# Altium schematic sheet DDR3.SchDoc
size 558 x 431 mm; SheetNumber: 6; SheetTotal: 23; Sheet_Name: DDR3; Size: 11x17
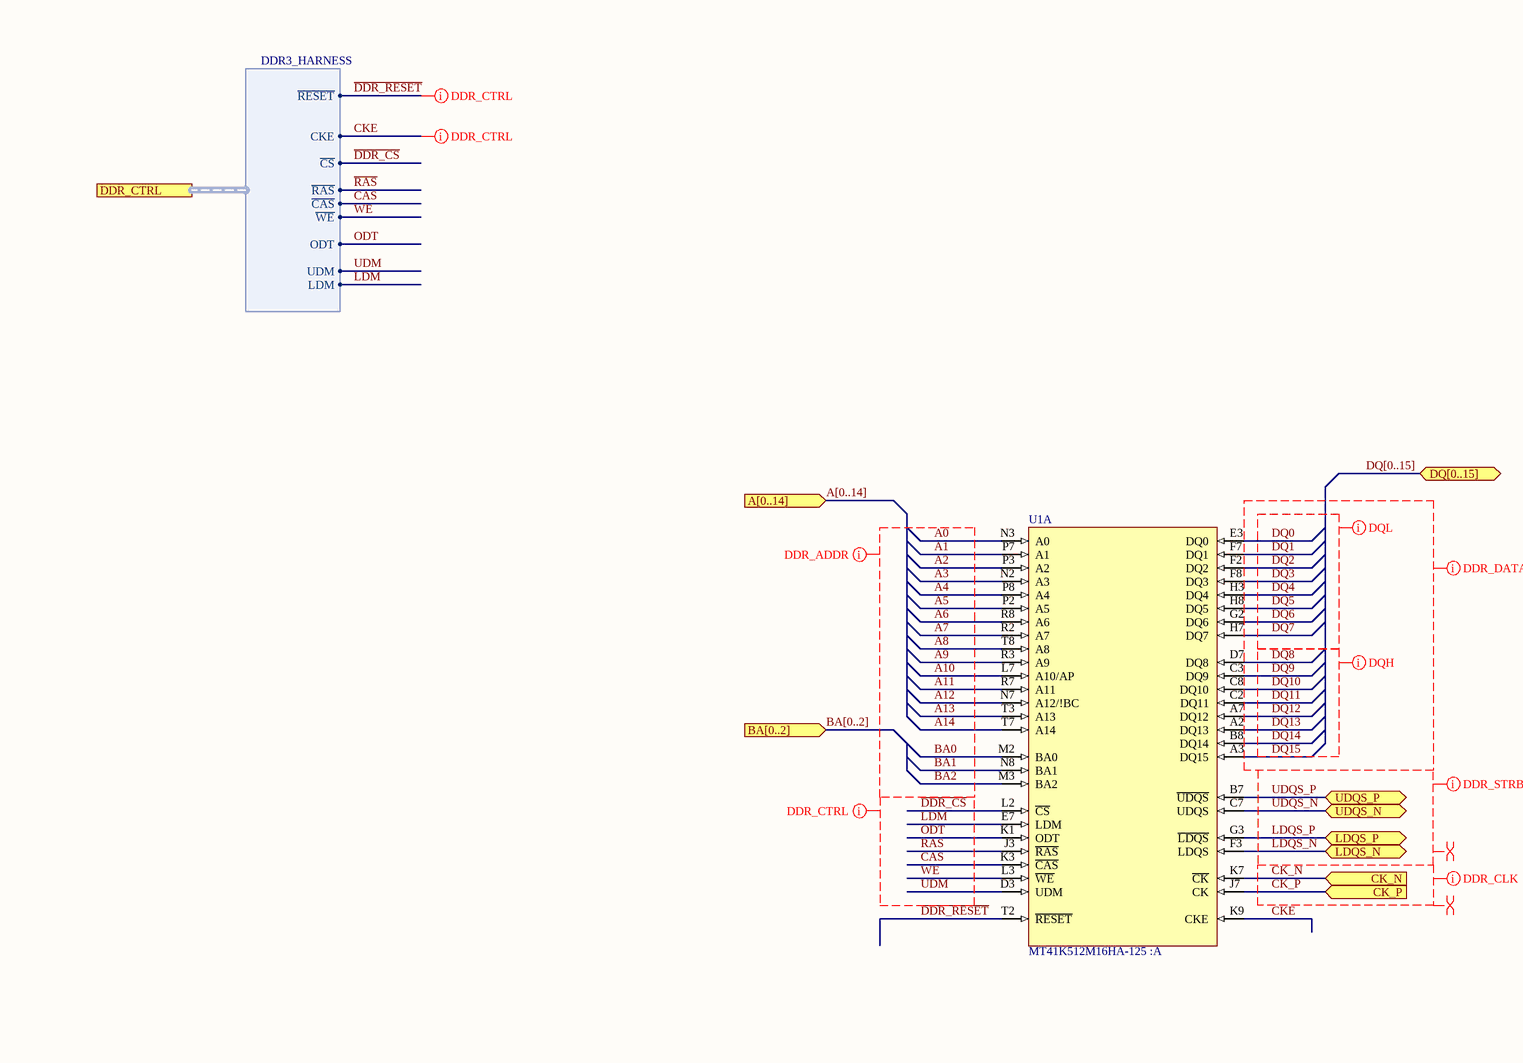
[diagram p0: DDR3.SchDoc, top left]
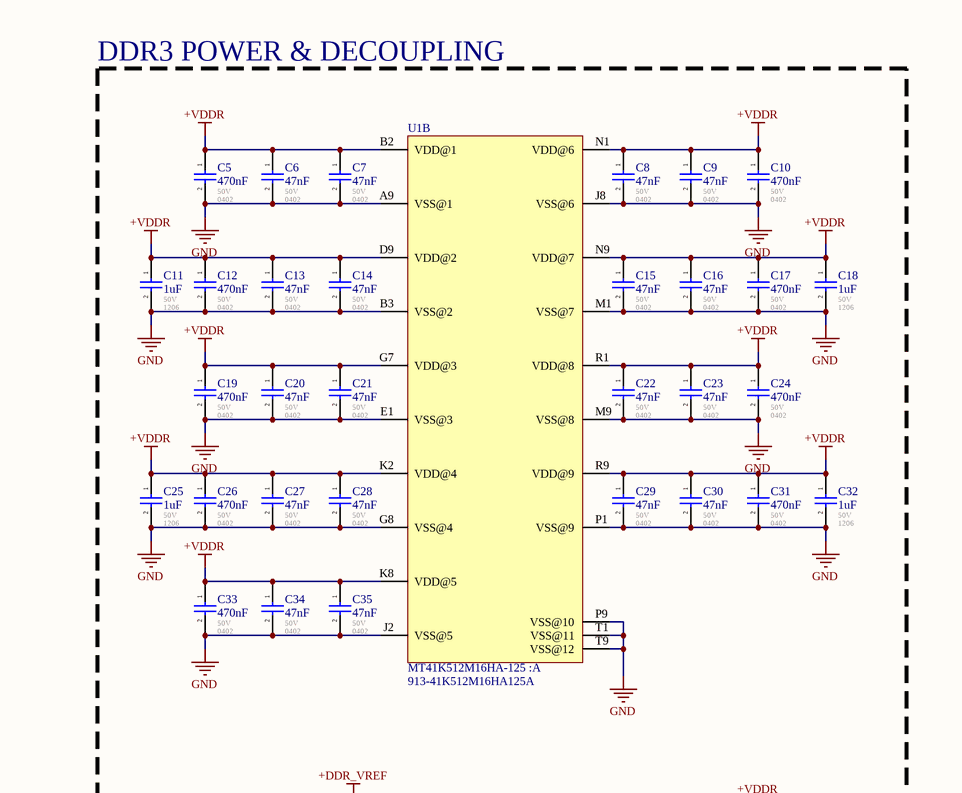
[diagram p1: DDR3.SchDoc, top right]
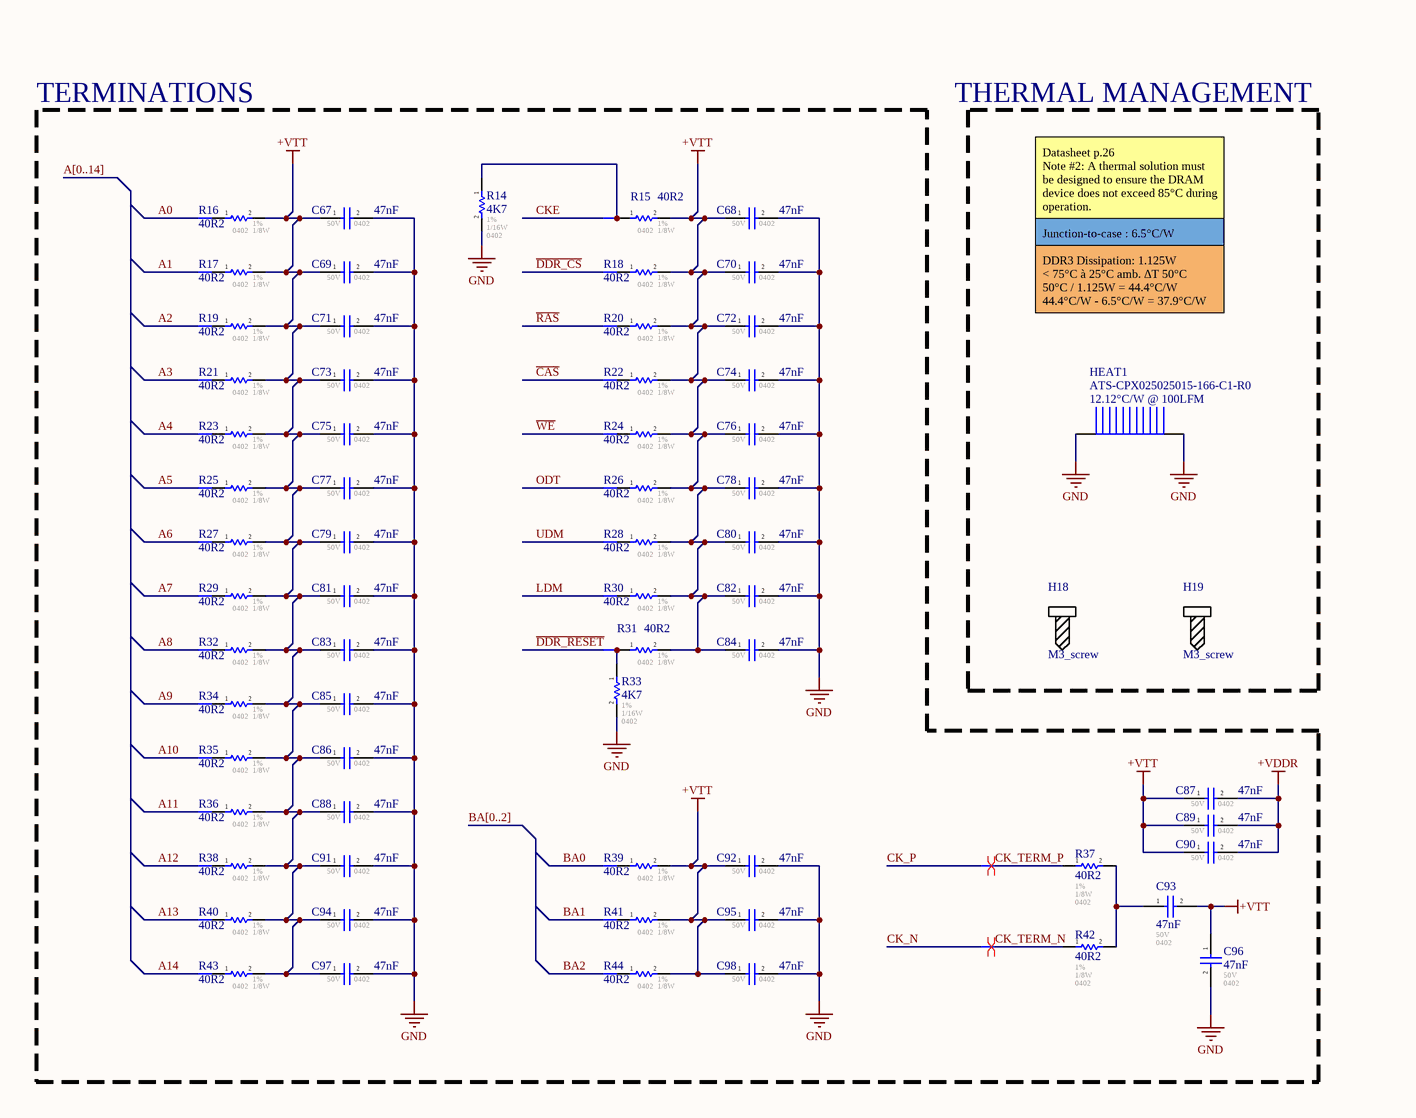
[diagram p2: DDR3.SchDoc, bottom left]
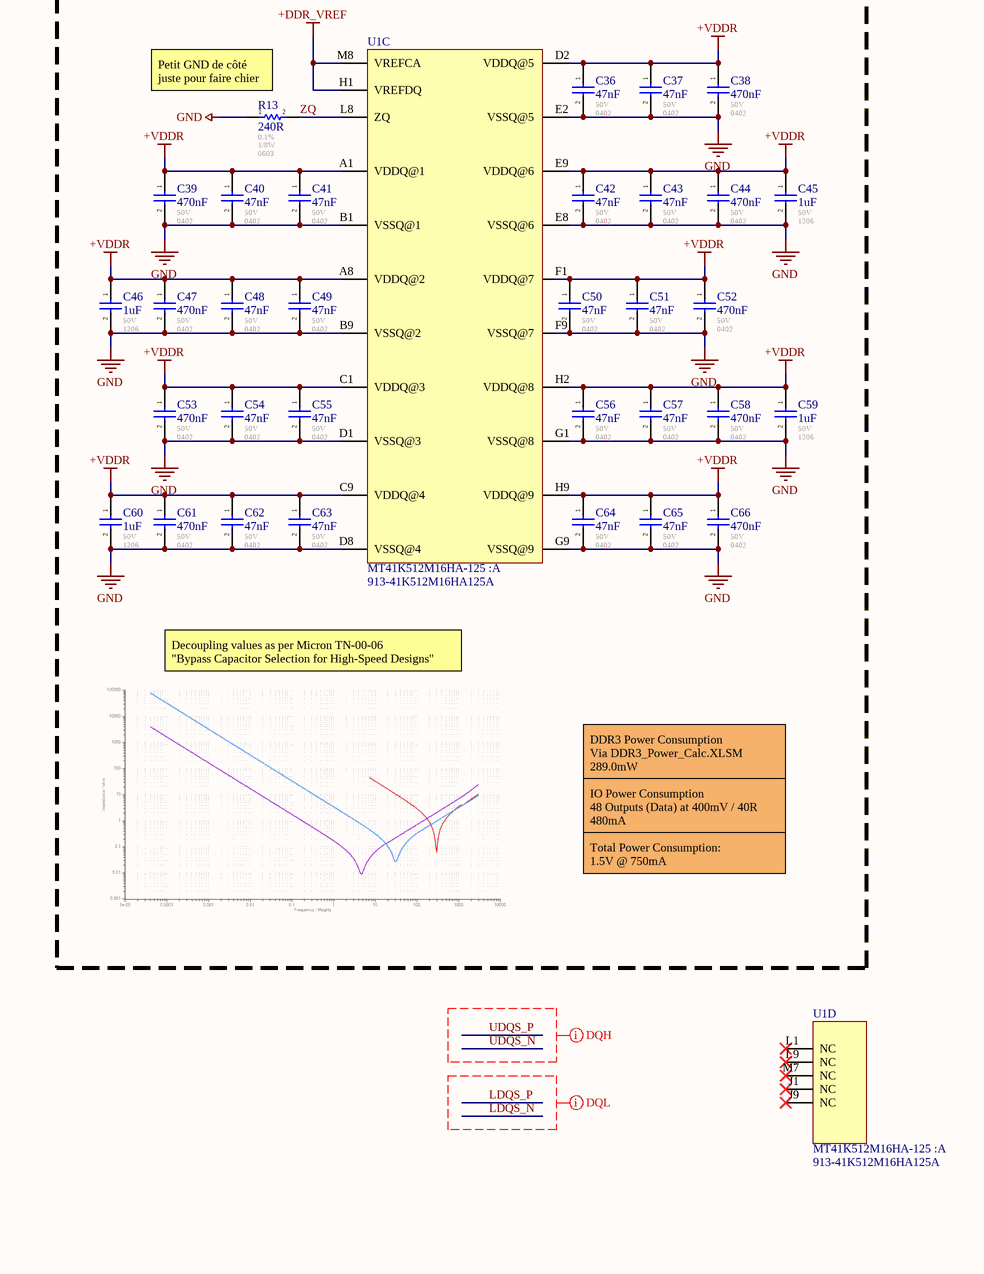
[diagram p3: DDR3.SchDoc, bottom right]

## Parts
C5  470nF  Voltage - Rated: 50V  Footprint: 0402  [CAP_0402]
C6  47nF  Voltage - Rated: 50V  Footprint: 0402  [CAP_0402]
C7  47nF  Voltage - Rated: 50V  Footprint: 0402  [CAP_0402]
C8  47nF  Voltage - Rated: 50V  Footprint: 0402  [CAP_0402]
C9  47nF  Voltage - Rated: 50V  Footprint: 0402  [CAP_0402]
C10  470nF  Voltage - Rated: 50V  Footprint: 0402  [CAP_0402]
C11  1uF  Voltage - Rated: 50V  Footprint: 1206  [CAP_1206]
C12  470nF  Voltage - Rated: 50V  Footprint: 0402  [CAP_0402]
C13  47nF  Voltage - Rated: 50V  Footprint: 0402  [CAP_0402]
C14  47nF  Voltage - Rated: 50V  Footprint: 0402  [CAP_0402]
C15  47nF  Voltage - Rated: 50V  Footprint: 0402  [CAP_0402]
C16  47nF  Voltage - Rated: 50V  Footprint: 0402  [CAP_0402]
C17  470nF  Voltage - Rated: 50V  Footprint: 0402  [CAP_0402]
C18  1uF  Voltage - Rated: 50V  Footprint: 1206  [CAP_1206]
C19  470nF  Voltage - Rated: 50V  Footprint: 0402  [CAP_0402]
C20  47nF  Voltage - Rated: 50V  Footprint: 0402  [CAP_0402]
C21  47nF  Voltage - Rated: 50V  Footprint: 0402  [CAP_0402]
C22  47nF  Voltage - Rated: 50V  Footprint: 0402  [CAP_0402]
C23  47nF  Voltage - Rated: 50V  Footprint: 0402  [CAP_0402]
C24  470nF  Voltage - Rated: 50V  Footprint: 0402  [CAP_0402]
C25  1uF  Voltage - Rated: 50V  Footprint: 1206  [CAP_1206]
C26  470nF  Voltage - Rated: 50V  Footprint: 0402  [CAP_0402]
C27  47nF  Voltage - Rated: 50V  Footprint: 0402  [CAP_0402]
C28  47nF  Voltage - Rated: 50V  Footprint: 0402  [CAP_0402]
C29  47nF  Voltage - Rated: 50V  Footprint: 0402  [CAP_0402]
C30  47nF  Voltage - Rated: 50V  Footprint: 0402  [CAP_0402]
C31  470nF  Voltage - Rated: 50V  Footprint: 0402  [CAP_0402]
C32  1uF  Voltage - Rated: 50V  Footprint: 1206  [CAP_1206]
C33  470nF  Voltage - Rated: 50V  Footprint: 0402  [CAP_0402]
C34  47nF  Voltage - Rated: 50V  Footprint: 0402  [CAP_0402]
C35  47nF  Voltage - Rated: 50V  Footprint: 0402  [CAP_0402]
C36  47nF  Voltage - Rated: 50V  Footprint: 0402  [CAP_0402]
C37  47nF  Voltage - Rated: 50V  Footprint: 0402  [CAP_0402]
C38  470nF  Voltage - Rated: 50V  Footprint: 0402  [CAP_0402]
C39  470nF  Voltage - Rated: 50V  Footprint: 0402  [CAP_0402]
C40  47nF  Voltage - Rated: 50V  Footprint: 0402  [CAP_0402]
C41  47nF  Voltage - Rated: 50V  Footprint: 0402  [CAP_0402]
C42  47nF  Voltage - Rated: 50V  Footprint: 0402  [CAP_0402]
C43  47nF  Voltage - Rated: 50V  Footprint: 0402  [CAP_0402]
C44  470nF  Voltage - Rated: 50V  Footprint: 0402  [CAP_0402]
C45  1uF  Voltage - Rated: 50V  Footprint: 1206  [CAP_1206]
C46  1uF  Voltage - Rated: 50V  Footprint: 1206  [CAP_1206]
C47  470nF  Voltage - Rated: 50V  Footprint: 0402  [CAP_0402]
C48  47nF  Voltage - Rated: 50V  Footprint: 0402  [CAP_0402]
C49  47nF  Voltage - Rated: 50V  Footprint: 0402  [CAP_0402]
C50  47nF  Voltage - Rated: 50V  Footprint: 0402  [CAP_0402]
C51  47nF  Voltage - Rated: 50V  Footprint: 0402  [CAP_0402]
C52  470nF  Voltage - Rated: 50V  Footprint: 0402  [CAP_0402]
C53  470nF  Voltage - Rated: 50V  Footprint: 0402  [CAP_0402]
C54  47nF  Voltage - Rated: 50V  Footprint: 0402  [CAP_0402]
C55  47nF  Voltage - Rated: 50V  Footprint: 0402  [CAP_0402]
C56  47nF  Voltage - Rated: 50V  Footprint: 0402  [CAP_0402]
C57  47nF  Voltage - Rated: 50V  Footprint: 0402  [CAP_0402]
C58  470nF  Voltage - Rated: 50V  Footprint: 0402  [CAP_0402]
C59  1uF  Voltage - Rated: 50V  Footprint: 1206  [CAP_1206]
C60  1uF  Voltage - Rated: 50V  Footprint: 1206  [CAP_1206]
C61  470nF  Voltage - Rated: 50V  Footprint: 0402  [CAP_0402]
C62  47nF  Voltage - Rated: 50V  Footprint: 0402  [CAP_0402]
C63  47nF  Voltage - Rated: 50V  Footprint: 0402  [CAP_0402]
C64  47nF  Voltage - Rated: 50V  Footprint: 0402  [CAP_0402]
C65  47nF  Voltage - Rated: 50V  Footprint: 0402  [CAP_0402]
C66  470nF  Voltage - Rated: 50V  Footprint: 0402  [CAP_0402]
C67  47nF  Voltage - Rated: 50V  Footprint: 0402  [CAP_0402]
C68  47nF  Voltage - Rated: 50V  Footprint: 0402  [CAP_0402]
C69  47nF  Voltage - Rated: 50V  Footprint: 0402  [CAP_0402]
C70  47nF  Voltage - Rated: 50V  Footprint: 0402  [CAP_0402]
C71  47nF  Voltage - Rated: 50V  Footprint: 0402  [CAP_0402]
C72  47nF  Voltage - Rated: 50V  Footprint: 0402  [CAP_0402]
C73  47nF  Voltage - Rated: 50V  Footprint: 0402  [CAP_0402]
C74  47nF  Voltage - Rated: 50V  Footprint: 0402  [CAP_0402]
C75  47nF  Voltage - Rated: 50V  Footprint: 0402  [CAP_0402]
C76  47nF  Voltage - Rated: 50V  Footprint: 0402  [CAP_0402]
C77  47nF  Voltage - Rated: 50V  Footprint: 0402  [CAP_0402]
C78  47nF  Voltage - Rated: 50V  Footprint: 0402  [CAP_0402]
C79  47nF  Voltage - Rated: 50V  Footprint: 0402  [CAP_0402]
C80  47nF  Voltage - Rated: 50V  Footprint: 0402  [CAP_0402]
C81  47nF  Voltage - Rated: 50V  Footprint: 0402  [CAP_0402]
C82  47nF  Voltage - Rated: 50V  Footprint: 0402  [CAP_0402]
C83  47nF  Voltage - Rated: 50V  Footprint: 0402  [CAP_0402]
C84  47nF  Voltage - Rated: 50V  Footprint: 0402  [CAP_0402]
C85  47nF  Voltage - Rated: 50V  Footprint: 0402  [CAP_0402]
C86  47nF  Voltage - Rated: 50V  Footprint: 0402  [CAP_0402]
C87  47nF  Voltage - Rated: 50V  Footprint: 0402  [CAP_0402]
C88  47nF  Voltage - Rated: 50V  Footprint: 0402  [CAP_0402]
C89  47nF  Voltage - Rated: 50V  Footprint: 0402  [CAP_0402]
C90  47nF  Voltage - Rated: 50V  Footprint: 0402  [CAP_0402]
C91  47nF  Voltage - Rated: 50V  Footprint: 0402  [CAP_0402]
C92  47nF  Voltage - Rated: 50V  Footprint: 0402  [CAP_0402]
C93  47nF  Voltage - Rated: 50V  Footprint: 0402  [CAP_0402]
C94  47nF  Voltage - Rated: 50V  Footprint: 0402  [CAP_0402]
C95  47nF  Voltage - Rated: 50V  Footprint: 0402  [CAP_0402]
C96  47nF  Voltage - Rated: 50V  Footprint: 0402  [CAP_0402]
C97  47nF  Voltage - Rated: 50V  Footprint: 0402  [CAP_0402]
C98  47nF  Voltage - Rated: 50V  Footprint: 0402  [CAP_0402]
H18  M3_screw  (mechanical)
H19  M3_screw  (mechanical)
HEAT1  ATS-CPX025025015-166-C1-R0  Thermal Resistance: 12.12°C/W @ 100LFM  [ATS-CPX025025015-166-C1-R0]
NT1  Net Tie  [NETTIE_9]  (value not drawn)  (net tie, no BOM)
NT2  Net Tie  [NETTIE_9]  (value not drawn)  (net tie, no BOM)
NT3  Net Tie  [NETTIE_9]  (value not drawn)  (net tie, no BOM)
NT4  Net Tie  [NETTIE_9]  (value not drawn)  (net tie, no BOM)
NT5  Net Tie  [NETTIE_9]  (value not drawn)  (net tie, no BOM)
NT6  Net Tie  [NETTIE_9]  (value not drawn)  (net tie, no BOM)
NT7  Net Tie  [NETTIE_9]  (value not drawn)  (net tie, no BOM)
NT8  Net Tie  [NETTIE_9]  (value not drawn)  (net tie, no BOM)
NT9  Net Tie  [NETTIE_9]  (value not drawn)  (net tie, no BOM)
NT10  Net Tie  [NETTIE_9]  (value not drawn)  (net tie, no BOM)
NT11  Net Tie  [NETTIE_9]  (value not drawn)  (net tie, no BOM)
NT12  Net Tie  [NETTIE_9]  (value not drawn)  (net tie, no BOM)
NT13  Net Tie  [NETTIE_9]  (value not drawn)  (net tie, no BOM)
NT14  Net Tie  [NETTIE_9]  (value not drawn)  (net tie, no BOM)
NT15  Net Tie  [NETTIE_9]  (value not drawn)  (net tie, no BOM)
NT16  Net Tie  [NETTIE_9]  (value not drawn)  (net tie, no BOM)
NT17  Net Tie  [NETTIE_9]  (value not drawn)  (net tie, no BOM)
NT18  Net Tie  [NETTIE_9]  (value not drawn)  (net tie, no BOM)
NT19  Net Tie  [NETTIE_9]  (value not drawn)  (net tie, no BOM)
NT20  Net Tie  [NETTIE_9]  (value not drawn)  (net tie, no BOM)
NT21  Net Tie  [NETTIE_9]  (value not drawn)  (net tie, no BOM)
NT22  Net Tie  [NETTIE_9]  (value not drawn)  (net tie, no BOM)
NT23  Net Tie  [NETTIE_9]  (value not drawn)  (net tie, no BOM)
NT24  Net Tie  [NETTIE_9]  (value not drawn)  (net tie, no BOM)
NT25  Net Tie  [NETTIE_9]  (value not drawn)  (net tie, no BOM)
NT26  Net Tie  [NETTIE_9]  (value not drawn)  (net tie, no BOM)
NT27  Net Tie  [NETTIE_9]  (value not drawn)  (net tie, no BOM)
NT28  Net Tie  [NETTIE_9]  (value not drawn)  (net tie, no BOM)
NT29  Net Tie  [NETTIE_9]  (value not drawn)  (net tie, no BOM)
R13  240R  Tolerance: 0.1%  Power: 1/8W  Package / Case: 0603  [RES_0603]
R14  4K7  Tolerance: 1%  Power: 1/16W  Package / Case: 0402  [RES_0402]
R15  40R2  Tolerance: 1%  Power: 1/8W  Package / Case: 0402  [RES_0402]
R16  40R2  Tolerance: 1%  Power: 1/8W  Package / Case: 0402  [RES_0402]
R17  40R2  Tolerance: 1%  Power: 1/8W  Package / Case: 0402  [RES_0402]
R18  40R2  Tolerance: 1%  Power: 1/8W  Package / Case: 0402  [RES_0402]
R19  40R2  Tolerance: 1%  Power: 1/8W  Package / Case: 0402  [RES_0402]
R20  40R2  Tolerance: 1%  Power: 1/8W  Package / Case: 0402  [RES_0402]
R21  40R2  Tolerance: 1%  Power: 1/8W  Package / Case: 0402  [RES_0402]
R22  40R2  Tolerance: 1%  Power: 1/8W  Package / Case: 0402  [RES_0402]
R23  40R2  Tolerance: 1%  Power: 1/8W  Package / Case: 0402  [RES_0402]
R24  40R2  Tolerance: 1%  Power: 1/8W  Package / Case: 0402  [RES_0402]
R25  40R2  Tolerance: 1%  Power: 1/8W  Package / Case: 0402  [RES_0402]
R26  40R2  Tolerance: 1%  Power: 1/8W  Package / Case: 0402  [RES_0402]
R27  40R2  Tolerance: 1%  Power: 1/8W  Package / Case: 0402  [RES_0402]
R28  40R2  Tolerance: 1%  Power: 1/8W  Package / Case: 0402  [RES_0402]
R29  40R2  Tolerance: 1%  Power: 1/8W  Package / Case: 0402  [RES_0402]
R30  40R2  Tolerance: 1%  Power: 1/8W  Package / Case: 0402  [RES_0402]
R31  40R2  Tolerance: 1%  Power: 1/8W  Package / Case: 0402  [RES_0402]
R32  40R2  Tolerance: 1%  Power: 1/8W  Package / Case: 0402  [RES_0402]
R33  4K7  Tolerance: 1%  Power: 1/16W  Package / Case: 0402  [RES_0402]
R34  40R2  Tolerance: 1%  Power: 1/8W  Package / Case: 0402  [RES_0402]
R35  40R2  Tolerance: 1%  Power: 1/8W  Package / Case: 0402  [RES_0402]
R36  40R2  Tolerance: 1%  Power: 1/8W  Package / Case: 0402  [RES_0402]
R37  40R2  Tolerance: 1%  Power: 1/8W  Package / Case: 0402  [RES_0402]
R38  40R2  Tolerance: 1%  Power: 1/8W  Package / Case: 0402  [RES_0402]
R39  40R2  Tolerance: 1%  Power: 1/8W  Package / Case: 0402  [RES_0402]
R40  40R2  Tolerance: 1%  Power: 1/8W  Package / Case: 0402  [RES_0402]
R41  40R2  Tolerance: 1%  Power: 1/8W  Package / Case: 0402  [RES_0402]
R42  40R2  Tolerance: 1%  Power: 1/8W  Package / Case: 0402  [RES_0402]
R43  40R2  Tolerance: 1%  Power: 1/8W  Package / Case: 0402  [RES_0402]
R44  40R2  Tolerance: 1%  Power: 1/8W  Package / Case: 0402  [RES_0402]
U1  MT41K512M16HA-125 :A  [FBGA-96]  (parts A,B,C,D of 4)

## Blocks framed on the sheet
DDR3 POWER & DECOUPLING: C5-C66 R13 U1

## Ports
A[0..14] (in), BA[0..2] (in), CK_N (in), CK_P (in), DDR_CTRL (harness DDR3_HARNESS), DQ[0..15] (bidir), LDQS_N (bidir), LDQS_P (bidir), UDQS_N (bidir), UDQS_P (bidir)

## Harnesses
DDR3_HARNESS: ~{RESET}, CKE, ~{CS}, ~{RAS}, ~{CAS}, ~{WE}, ODT, UDM, LDM

## Nets
+DDR_VREF: U1.H1(VREFDQ) U1.M8(VREFCA)
+VDDR: C5.1 C6.1 C7.1 C8.1 C9.1 C10.1 C11.1 C12.1 C13.1 C14.1 C15.1 C16.1 C17.1 C18.1 C19.1 C20.1 C21.1 C22.1 C23.1 C24.1 C25.1 C26.1 C27.1 C28.1 C29.1 C30.1 C31.1 C32.1 C33.1 C34.1 C35.1 C36.1 C37.1 C38.1 C39.1 C40.1 C41.1 C42.1 C43.1 C44.1 C45.1 C46.1 C47.1 C48.1 C49.1 C50.1 C51.1 C52.1 C53.1 C54.1 C55.1 C56.1 C57.1 C58.1 C59.1 C60.1 C61.1 C62.1 C63.1 C64.1 C65.1 C66.1 C87.2 C89.2 C90.2 U1.A1(VDDQ@1) U1.A8(VDDQ@2) U1.B2(VDD@1) U1.C1(VDDQ@3) U1.C9(VDDQ@4) U1.D2(VDDQ@5) U1.D9(VDD@2) U1.E9(VDDQ@6) U1.F1(VDDQ@7) U1.G7(VDD@3) U1.H2(VDDQ@8) U1.H9(VDDQ@9) U1.K2(VDD@4) U1.K8(VDD@5) U1.N1(VDD@6) U1.N9(VDD@7) U1.R1(VDD@8) U1.R9(VDD@9)
+VTT: C67.1 C68.1 C69.1 C70.1 C71.1 C72.1 C73.1 C74.1 C75.1 C76.1 C77.1 C78.1 C79.1 C80.1 C81.1 C82.1 C83.1 C84.1 C85.1 C86.1 C87.1 C88.1 C89.1 C90.1 C91.1 C92.1 C93.2 C94.1 C95.1 C96.1 C97.1 C98.1 R15.2 R16.2 R17.2 R18.2 R19.2 R20.2 R21.2 R22.2 R23.2 R24.2 R25.2 R26.2 R27.2 R28.2 R29.2 R30.2 R31.2 R32.2 R34.2 R35.2 R36.2 R38.2 R39.2 R40.2 R41.2 R43.2 R44.2
GND: C5.2 C6.2 C7.2 C8.2 C9.2 C10.2 C11.2 C12.2 C13.2 C14.2 C15.2 C16.2 C17.2 C18.2 C19.2 C20.2 C21.2 C22.2 C23.2 C24.2 C25.2 C26.2 C27.2 C28.2 C29.2 C30.2 C31.2 C32.2 C33.2 C34.2 C35.2 C36.2 C37.2 C38.2 C39.2 C40.2 C41.2 C42.2 C43.2 C44.2 C45.2 C46.2 C47.2 C48.2 C49.2 C50.2 C51.2 C52.2 C53.2 C54.2 C55.2 C56.2 C57.2 C58.2 C59.2 C60.2 C61.2 C62.2 C63.2 C64.2 C65.2 C66.2 C67.2 C68.2 C69.2 C70.2 C71.2 C72.2 C73.2 C74.2 C75.2 C76.2 C77.2 C78.2 C79.2 C80.2 C81.2 C82.2 C83.2 C84.2 C85.2 C86.2 C88.2 C91.2 C92.2 C94.2 C95.2 C96.2 C97.2 C98.2 HEAT1.1 HEAT1.2 R13.1 R14.2 R33.2 U1.A9(VSS@1) U1.B1(VSSQ@1) U1.B3(VSS@2) U1.B9(VSSQ@2) U1.D1(VSSQ@3) U1.D8(VSSQ@4) U1.E1(VSS@3) U1.E2(VSSQ@5) U1.E8(VSSQ@6) U1.F9(VSSQ@7) U1.G1(VSSQ@8) U1.G8(VSS@4) U1.G9(VSSQ@9) U1.J2(VSS@5) U1.J8(VSS@6) U1.M1(VSS@7) U1.M9(VSS@8) U1.P1(VSS@9) U1.P9(VSS@10) U1.T1(VSS@11) U1.T9(VSS@12)
~{CAS}: NT8.2 U1.K3(~{CAS}) ; port DDR_CTRL.~{CAS}
~{DDR_CS}: NT4.2 U1.L2(~{CS}) ; port DDR_CTRL.~{CS}
~{DDR_RESET}: NT18.2 U1.T2(~{RESET}) ; port DDR_CTRL.~{RESET}
~{RAS}: NT6.2 U1.J3(~{RAS}) ; port DDR_CTRL.~{RAS}
~{WE}: NT10.2 U1.L3(~{WE}) ; port DDR_CTRL.~{WE}
A0: NT1.2 U1.N3(A0)
A1: NT3.2 U1.P7(A1)
A2: NT5.2 U1.P3(A2)
A3: NT7.2 U1.N2(A3)
A4: NT9.2 U1.P8(A4)
A5: NT11.2 U1.P2(A5)
A6: NT13.2 U1.R8(A6)
A7: NT15.2 U1.R2(A7)
A8: NT17.2 U1.T8(A8)
A9: NT19.2 U1.R3(A9)
A10: NT20.2 U1.L7(A10/AP)
A11: NT21.2 U1.R7(A11)
A12: NT22.2 U1.N7(A12/!BC)
A13: NT25.2 U1.T3(A13)
A14: NT28.2 U1.T7(A14)
BA0: NT23.2 U1.M2(BA0)
BA1: NT26.2 U1.N8(BA1)
BA2: NT29.2 U1.M3(BA2)
CK_N: NT27.2 U1.K7(~{CK}) ; port CK_N
CK_P: NT24.2 U1.J7(CK) ; port CK_P
CK_TERM_N: NT27.1 R42.1
CK_TERM_P: NT24.1 R37.1
CKE: NT2.2 U1.K9(CKE) ; port DDR_CTRL.CKE
DQ0: U1.E3(DQ0)
DQ1: U1.F7(DQ1)
DQ2: U1.F2(DQ2)
DQ3: U1.F8(DQ3)
DQ4: U1.H3(DQ4)
DQ5: U1.H8(DQ5)
DQ6: U1.G2(DQ6)
DQ7: U1.H7(DQ7)
DQ8: U1.D7(DQ8)
DQ9: U1.C3(DQ9)
DQ10: U1.C8(DQ10)
DQ11: U1.C2(DQ11)
DQ12: U1.A7(DQ12)
DQ13: U1.A2(DQ13)
DQ14: U1.B8(DQ14)
DQ15: U1.A3(DQ15)
LDM: NT16.2 U1.E7(LDM) ; port DDR_CTRL.LDM
LDQS_N: U1.F3(LDQS) ; port LDQS_N
LDQS_P: U1.G3(~{LDQS}) ; port LDQS_P
ODT: NT12.2 U1.K1(ODT) ; port DDR_CTRL.ODT
UDM: NT14.2 U1.D3(UDM) ; port DDR_CTRL.UDM
UDQS_N: U1.C7(UDQS) ; port UDQS_N
UDQS_P: U1.B7(~{UDQS}) ; port UDQS_P
ZQ: R13.2 U1.L8(ZQ)
NetC93_1: C93.1 R37.2 R42.2
NetNT1_1: NT1.1 R16.1
NetNT2_1: NT2.1 R14.1 R15.1
NetNT3_1: NT3.1 R17.1
NetNT4_1: NT4.1 R18.1
NetNT5_1: NT5.1 R19.1
NetNT6_1: NT6.1 R20.1
NetNT7_1: NT7.1 R21.1
NetNT8_1: NT8.1 R22.1
NetNT9_1: NT9.1 R23.1
NetNT10_1: NT10.1 R24.1
NetNT11_1: NT11.1 R25.1
NetNT12_1: NT12.1 R26.1
NetNT13_1: NT13.1 R27.1
NetNT14_1: NT14.1 R28.1
NetNT15_1: NT15.1 R29.1
NetNT16_1: NT16.1 R30.1
NetNT17_1: NT17.1 R32.1
NetNT18_1: NT18.1 R31.1 R33.1
NetNT19_1: NT19.1 R34.1
NetNT20_1: NT20.1 R35.1
NetNT21_1: NT21.1 R36.1
NetNT22_1: NT22.1 R38.1
NetNT23_1: NT23.1 R39.1
NetNT25_1: NT25.1 R40.1
NetNT26_1: NT26.1 R41.1
NetNT28_1: NT28.1 R43.1
NetNT29_1: NT29.1 R44.1

Not connected (* = marked no-connect by the designer): U1 J1(NC)* J9(NC)* L1(NC)* L9(NC)* M7(NC)*

## Buses and harness runs
bus A[0..14]
bus A[0..14] = port A[0..14]
bus BA[0..2]
bus BA[0..2] = port BA[0..2]
bus DQ[0..15] = port DQ[0..15]

## Layout directives
net class DDR_CLK; net class ACC: CK_N, CK_P
differential pair: CK_N, CK_P, CK_TERM_N, CK_TERM_P, LDQS_N, LDQS_P, UDQS_N, UDQS_P
net class DDR_CLK; net class DDR_DATA: LDQS_N, LDQS_P, UDQS_N, UDQS_P
net class DDR_DATA: DQ0, DQ1, DQ2, DQ3, DQ4, DQ5, DQ6, DQ7, DQ8, DQ9, DQ10, DQ11, DQ12, DQ13, DQ14, DQ15
net class ACC; net class DDR_ADDR: A0, A1, A2, A3, A4, A5, A6, A7, A8, A9, A10, A11, A12, A13, A14, BA0, BA1, BA2
net class ACC: CKE, LDM, ODT, UDM, ~{CAS}, ~{DDR_CS}, ~{DDR_RESET}, ~{RAS}, ~{WE}
net class DQL: DQ0, DQ1, DQ2, DQ3, DQ4, DQ5, DQ6, DQ7, LDQS_N, LDQS_P
net class DQH: DQ8, DQ9, DQ10, DQ11, DQ12, DQ13, DQ14, DQ15, UDQS_N, UDQS_P

## Notes on the sheet
- (near R13) Petit GND de côté juste pour faire chier
- TERMINATIONS
- THERMAL MANAGEMENT
- Datasheet p.26
  Note #2: A thermal solution must be designed to ensure the DRAM device does not exceed 85°C during operation.
- Junction-to-case : 6.5°C/W
- DDR3 Dissipation: 1.125W
  < 75°C à 25°C amb. ΔT 50°C
  50°C / 1.125W = 44.4°C/W
  44.4°C/W - 6.5°C/W = 37.9°C/W
- Decoupling values as per Micron TN-00-06
  "Bypass Capacitor Selection for High-Speed Designs"
- DDR3 Power Consumption
  Via DDR3_Power_Calc.XLSM
  289.0mW
- IO Power Consumption
  48 Outputs (Data) at 400mV / 40R
  480mA
- Total Power Consumption:
  1.5V @ 750mA
- Sheet Name
- Project Title
- Global Project
- Revision
- Size
- Date
- Group
- Sheet
- of
- Filename
- Designers

## Library data of the parts
C5 C10 C12 C17 C19 C24 C26 C31 C33 C38 C39 C44 C47 C52 C53 C58 C61 C66 = CAP_CER: CGA3E3X7R1H474K080AB / 0603 470nF 10% X7R Ceramic Capacitor; Mfr: TDK; Operating Temperature: -55C - 125C; Temperature Coefficient: X7R; ComponentLink1Description: Digikey; ComponentLink1URL: [Digikey Link]; Part#: CGA3E3X7R1H474K080AB; ComponentLink2Description: Datasheet; ComponentLink2URL: [Datasheet Link]; Tolerance: 10%; Ratings: AEC-Q200
C6-C9 C13-C16 C20-C23 C27-C30 C34-C37 C40-C43 C48-C51 C54-C57 C62-C65 C67-C98 = CAP_CER: GCM155R71H473KE02J / 0402 47nF 10% X7R Ceramic Capacitor; Mfr: Murata; Operating Temperature: -55C - 125C; Temperature Coefficient: X7R; ComponentLink1Description: Digikey; ComponentLink1URL: [Digikey Link]; Part#: GCM155R71H473KE02J; ComponentLink2Description: Datasheet; ComponentLink2URL: [Datasheet Link]; Tolerance: 10%; Ratings: AEC-Q200
C11 C18 C25 C32 C45 C46 C59 C60 = CAP_CER: GCJ31CR71H105KA12L / 1206 1uF 10% X7R Ceramic Capacitor; Mfr: Murata; Operating Temperature: -55C - 125C; Temperature Coefficient: X7R; ComponentLink1Description: Digikey; ComponentLink1URL: [Digikey Link]; Part#: GCJ31CR71H105KA12L; ComponentLink2Description: Datasheet; ComponentLink2URL: [Datasheet Link]; Tolerance: 10%; Ratings: AEC-Q200
HEAT1 = HEATSINK_ATS-CPX025025015-166-C1-R0: Heatsink Aluminium; Mfr: Advanced Thermal Solutions Inc.; Hole Size: 3.175mm; Hole-to-hole: 42.42mm; Fin Height: 15mm; Length: 25mm; Width: 25mm; Material: Aluminium; ComponentLink1Description: Digikey; ComponentLink1URL: https://www.digikey.ca/en/products/detail/advanced-thermal-solutions-inc/ATS-CPX025025015-166-C1-R0/4753829; ComponentLink2Description: Mfr; ComponentLink2URL: https://www.qats.com/Search/HeatSink/2670.aspx; Supplier 1: Digikey; Supplier Part Number 1: ATS35911-ND
NT1-NT29 = NET_TIE_SMALL
R13-R44 = RESISTOR: Automotive: AEC-Q200; Operating Temperature: *; # Digikey: *; ComponentLink1Description: Digikey; ComponentLink1URL: *; # Manufacturer: *
U1 = IC_MT41K512M16HA-125: DRAM 8G 1.35V 512Mx16 800 MHz DDR3 0C-90C; Mfr: Alliance Memory; Data Bus Width: 16 bits; Memory Size: 8Gb; Maximum Clock Frequency: 800MHz; Supply Voltage (Max): 1.45V; Supply Voltage (Min): 1.283V; Supply Current (Max): 88mA; Package / Case: FBGA-96; Type: SDRAM - DDR3L; Memory Organization: 512M x 16; Operating Temperature: 0C - 95C; ComponentLink1Description: Digikey; ComponentLink1URL: https://www.digikey.ca/en/products/detail/alliance-memory-inc/MT41K512M16HA-125:A/10821776; ComponentLink2Description: Datasheet; ComponentLink2URL: https://media.digikey.com/pdf/Data%20Sheets/Micron%20Technology%20Inc%20PDFs/MT41K_2G4,1G8,512M16_8Gb_DDR3L.pdf; Digikey #: 1450-MT41K512M16HA-125:A-ND; Supplier 1: Mouser; Supplier Part Number 1: 913-41K512M16HA125A